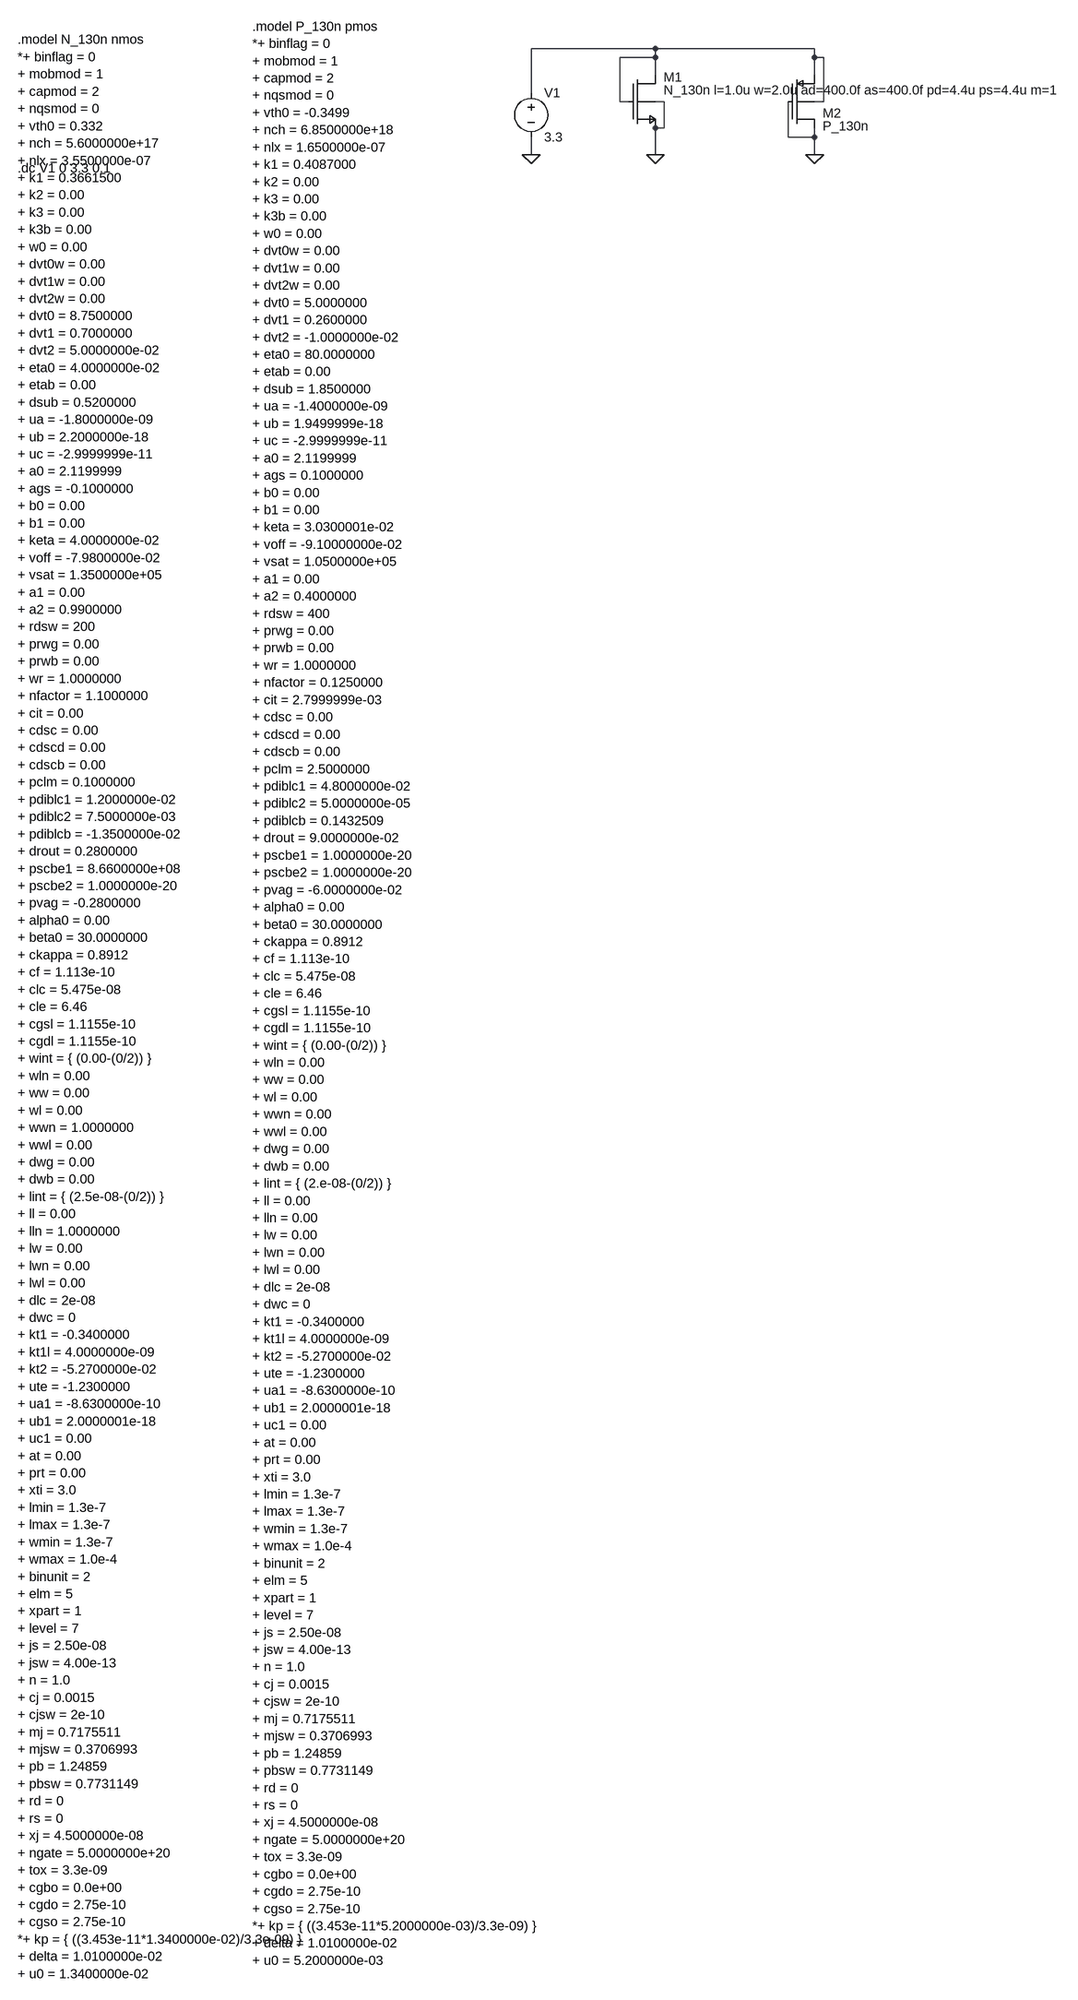
[diagram p0: schematic ekvParameterExtractionEdited.asc]
ekvParameterExtractionEdited.asc, the LTspice schematic file:
Version 4
SHEET 1 880 3184
WIRE 272 32 16 32
WIRE 560 32 272 32
WIRE 272 48 272 32
WIRE 272 48 208 48
WIRE 560 48 560 32
WIRE 576 48 560 48
WIRE 272 80 272 48
WIRE 560 80 560 48
WIRE 16 112 16 32
WIRE 208 128 208 48
WIRE 224 128 208 128
WIRE 288 128 272 128
WIRE 576 128 576 48
WIRE 576 128 560 128
WIRE 288 176 288 128
WIRE 288 176 272 176
WIRE 512 192 512 128
WIRE 560 192 560 176
WIRE 560 192 512 192
WIRE 16 224 16 192
WIRE 272 224 272 176
WIRE 560 224 560 192
FLAG 16 224 0
FLAG 272 224 0
FLAG 560 224 0
SYMBOL voltage 16 96 R0
WINDOW 123 0 0 Left 0
WINDOW 39 0 0 Left 0
SYMATTR InstName V1
SYMATTR Value 3.3
SYMBOL nmosb 224 80 R0
SYMATTR InstName M1
SYMATTR Value2 l=1.0u w=2.0u ad=400.0f as=400.0f pd=4.4u ps=4.4u m=1
SYMATTR Value N_130n l=1.0u w=2.0u ad=400.0f as=400.0f pd=4.4u ps=4.4u m=1
SYMBOL pmosb 512 80 R0
WINDOW 0 63 69 Left 2
SYMATTR InstName M2
SYMATTR Value2 l=1.0u w=6.0u ad=1.2p as=1.2p pd=12.4u ps=12.4u m=1
SYMATTR Value P_130n
TEXT -912 16 Left 2 !.model N_130n nmos \n*+ binflag = 0 \n+ mobmod = 1 \n+ capmod = 2 \n+ nqsmod = 0 \n+ vth0 = 0.332 \n+ nch = 5.6000000e+17 \n+ nlx = 3.5500000e-07 \n+ k1 = 0.3661500 \n+ k2 = 0.00 \n+ k3 = 0.00 \n+ k3b = 0.00 \n+ w0 = 0.00 \n+ dvt0w = 0.00 \n+ dvt1w = 0.00 \n+ dvt2w = 0.00 \n+ dvt0 = 8.7500000 \n+ dvt1 = 0.7000000 \n+ dvt2 = 5.0000000e-02 \n+ eta0 = 4.0000000e-02 \n+ etab = 0.00 \n+ dsub = 0.5200000 \n+ ua = -1.8000000e-09 \n+ ub = 2.2000000e-18 \n+ uc = -2.9999999e-11 \n+ a0 = 2.1199999 \n+ ags = -0.1000000 \n+ b0 = 0.00 \n+ b1 = 0.00 \n+ keta = 4.0000000e-02 \n+ voff = -7.9800000e-02 \n+ vsat = 1.3500000e+05 \n+ a1 = 0.00 \n+ a2 = 0.9900000 \n+ rdsw = 200 \n+ prwg = 0.00 \n+ prwb = 0.00 \n+ wr = 1.0000000 \n+ nfactor = 1.1000000 \n+ cit = 0.00 \n+ cdsc = 0.00 \n+ cdscd = 0.00 \n+ cdscb = 0.00 \n+ pclm = 0.1000000 \n+ pdiblc1 = 1.2000000e-02 \n+ pdiblc2 = 7.5000000e-03 \n+ pdiblcb = -1.3500000e-02 \n+ drout = 0.2800000 \n+ pscbe1 = 8.6600000e+08 \n+ pscbe2 = 1.0000000e-20 \n+ pvag = -0.2800000 \n+ alpha0 = 0.00 \n+ beta0 = 30.0000000 \n+ ckappa = 0.8912 \n+ cf = 1.113e-10 \n+ clc = 5.475e-08 \n+ cle = 6.46 \n+ cgsl = 1.1155e-10 \n+ cgdl = 1.1155e-10 \n+ wint = { (0.00-(0/2)) } \n+ wln = 0.00 \n+ ww = 0.00 \n+ wl = 0.00 \n+ wwn = 1.0000000 \n+ wwl = 0.00 \n+ dwg = 0.00 \n+ dwb = 0.00 \n+ lint = { (2.5e-08-(0/2)) } \n+ ll = 0.00 \n+ lln = 1.0000000 \n+ lw = 0.00 \n+ lwn = 0.00 \n+ lwl = 0.00 \n+ dlc = 2e-08 \n+ dwc = 0 \n+ kt1 = -0.3400000 \n+ kt1l = 4.0000000e-09 \n+ kt2 = -5.2700000e-02 \n+ ute = -1.2300000 \n+ ua1 = -8.6300000e-10 \n+ ub1 = 2.0000001e-18 \n+ uc1 = 0.00 \n+ at = 0.00 \n+ prt = 0.00 \n+ xti = 3.0 \n+ lmin = 1.3e-7 \n+ lmax = 1.3e-7 \n+ wmin = 1.3e-7 \n+ wmax = 1.0e-4 \n+ binunit = 2 \n+ elm = 5\n+ xpart = 1 \n+ level = 7 \n+ js = 2.50e-08 \n+ jsw = 4.00e-13 \n+ n = 1.0 \n+ cj = 0.0015 \n+ cjsw = 2e-10 \n+ mj = 0.7175511 \n+ mjsw = 0.3706993 \n+ pb = 1.24859 \n+ pbsw = 0.7731149 \n+ rd = 0 \n+ rs = 0 \n+ xj = 4.5000000e-08 \n+ ngate = 5.0000000e+20 \n+ tox = 3.3e-09 \n+ cgbo = 0.0e+00 \n+ cgdo = 2.75e-10 \n+ cgso = 2.75e-10 \n*+ kp = { ((3.453e-11*1.3400000e-02)/3.3e-09) } \n+ delta = 1.0100000e-02 \n+ u0 = 1.3400000e-02
TEXT -488 -8 Left 2 !.model P_130n pmos \n*+ binflag = 0 \n+ mobmod = 1 \n+ capmod = 2 \n+ nqsmod = 0 \n+ vth0 = -0.3499 \n+ nch = 6.8500000e+18 \n+ nlx = 1.6500000e-07 \n+ k1 = 0.4087000 \n+ k2 = 0.00 \n+ k3 = 0.00 \n+ k3b = 0.00 \n+ w0 = 0.00 \n+ dvt0w = 0.00 \n+ dvt1w = 0.00 \n+ dvt2w = 0.00 \n+ dvt0 = 5.0000000 \n+ dvt1 = 0.2600000 \n+ dvt2 = -1.0000000e-02 \n+ eta0 = 80.0000000 \n+ etab = 0.00 \n+ dsub = 1.8500000 \n+ ua = -1.4000000e-09 \n+ ub = 1.9499999e-18 \n+ uc = -2.9999999e-11 \n+ a0 = 2.1199999 \n+ ags = 0.1000000 \n+ b0 = 0.00 \n+ b1 = 0.00 \n+ keta = 3.0300001e-02 \n+ voff = -9.10000000e-02 \n+ vsat = 1.0500000e+05 \n+ a1 = 0.00 \n+ a2 = 0.4000000 \n+ rdsw = 400 \n+ prwg = 0.00 \n+ prwb = 0.00 \n+ wr = 1.0000000 \n+ nfactor = 0.1250000 \n+ cit = 2.7999999e-03 \n+ cdsc = 0.00 \n+ cdscd = 0.00 \n+ cdscb = 0.00 \n+ pclm = 2.5000000 \n+ pdiblc1 = 4.8000000e-02 \n+ pdiblc2 = 5.0000000e-05 \n+ pdiblcb = 0.1432509 \n+ drout = 9.0000000e-02 \n+ pscbe1 = 1.0000000e-20 \n+ pscbe2 = 1.0000000e-20 \n+ pvag = -6.0000000e-02 \n+ alpha0 = 0.00 \n+ beta0 = 30.0000000 \n+ ckappa = 0.8912 \n+ cf = 1.113e-10 \n+ clc = 5.475e-08 \n+ cle = 6.46 \n+ cgsl = 1.1155e-10 \n+ cgdl = 1.1155e-10 \n+ wint = { (0.00-(0/2)) } \n+ wln = 0.00 \n+ ww = 0.00 \n+ wl = 0.00 \n+ wwn = 0.00 \n+ wwl = 0.00 \n+ dwg = 0.00 \n+ dwb = 0.00 \n+ lint = { (2.e-08-(0/2)) } \n+ ll = 0.00 \n+ lln = 0.00 \n+ lw = 0.00 \n+ lwn = 0.00 \n+ lwl = 0.00 \n+ dlc = 2e-08 \n+ dwc = 0 \n+ kt1 = -0.3400000 \n+ kt1l = 4.0000000e-09 \n+ kt2 = -5.2700000e-02 \n+ ute = -1.2300000 \n+ ua1 = -8.6300000e-10 \n+ ub1 = 2.0000001e-18 \n+ uc1 = 0.00 \n+ at = 0.00 \n+ prt = 0.00 \n+ xti = 3.0 \n+ lmin = 1.3e-7 \n+ lmax = 1.3e-7 \n+ wmin = 1.3e-7 \n+ wmax = 1.0e-4 \n+ binunit = 2 \n+ elm = 5 \n+ xpart = 1 \n+ level = 7 \n+ js = 2.50e-08 \n+ jsw = 4.00e-13 \n+ n = 1.0 \n+ cj = 0.0015 \n+ cjsw = 2e-10 \n+ mj = 0.7175511 \n+ mjsw = 0.3706993 \n+ pb = 1.24859 \n+ pbsw = 0.7731149 \n+ rd = 0 \n+ rs = 0 \n+ xj = 4.5000000e-08 \n+ ngate = 5.0000000e+20 \n+ tox = 3.3e-09 \n+ cgbo = 0.0e+00 \n+ cgdo = 2.75e-10 \n+ cgso = 2.75e-10 \n*+ kp = { ((3.453e-11*5.2000000e-03)/3.3e-09) } \n+ delta = 1.0100000e-02 \n+ u0 = 5.2000000e-03
TEXT -912 248 Left 2 !.dc V1 0 3.3 0.1

The netlist it stands for:
* ekvParameterExtractionEdited.asc
V1 N001 0 3.3
M1 N001 N001 0 0 N_130n l=1.0u w=2.0u ad=400.0f as=400.0f pd=4.4u ps=4.4u m=1 l=1.0u w=2.0u ad=400.0f as=400.0f pd=4.4u ps=4.4u m=1
M2 0 0 N001 N001 P_130n l=1.0u w=6.0u ad=1.2p as=1.2p pd=12.4u ps=12.4u m=1
.model NMOS NMOS
.model PMOS PMOS
.lib standard.mos
.model N_130n nmos
*+ binflag = 0
+ mobmod = 1
+ capmod = 2
+ nqsmod = 0
+ vth0 = 0.332
+ nch = 5.6000000e+17
+ nlx = 3.5500000e-07
+ k1 = 0.3661500
+ k2 = 0.00
+ k3 = 0.00
+ k3b = 0.00
+ w0 = 0.00
+ dvt0w = 0.00
+ dvt1w = 0.00
+ dvt2w = 0.00
+ dvt0 = 8.7500000
+ dvt1 = 0.7000000
+ dvt2 = 5.0000000e-02
+ eta0 = 4.0000000e-02
+ etab = 0.00
+ dsub = 0.5200000
+ ua = -1.8000000e-09
+ ub = 2.2000000e-18
+ uc = -2.9999999e-11
+ a0 = 2.1199999
+ ags = -0.1000000
+ b0 = 0.00
+ b1 = 0.00
+ keta = 4.0000000e-02
+ voff = -7.9800000e-02
+ vsat = 1.3500000e+05
+ a1 = 0.00
+ a2 = 0.9900000
+ rdsw = 200
+ prwg = 0.00
+ prwb = 0.00
+ wr = 1.0000000
+ nfactor = 1.1000000
+ cit = 0.00
+ cdsc = 0.00
+ cdscd = 0.00
+ cdscb = 0.00
+ pclm = 0.1000000
+ pdiblc1 = 1.2000000e-02
+ pdiblc2 = 7.5000000e-03
+ pdiblcb = -1.3500000e-02
+ drout = 0.2800000
+ pscbe1 = 8.6600000e+08
+ pscbe2 = 1.0000000e-20
+ pvag = -0.2800000
+ alpha0 = 0.00
+ beta0 = 30.0000000
+ ckappa = 0.8912
+ cf = 1.113e-10
+ clc = 5.475e-08
+ cle = 6.46
+ cgsl = 1.1155e-10
+ cgdl = 1.1155e-10
+ wint = { (0.00-(0/2)) }
+ wln = 0.00
+ ww = 0.00
+ wl = 0.00
+ wwn = 1.0000000
+ wwl = 0.00
+ dwg = 0.00
+ dwb = 0.00
+ lint = { (2.5e-08-(0/2)) }
+ ll = 0.00
+ lln = 1.0000000
+ lw = 0.00
+ lwn = 0.00
+ lwl = 0.00
+ dlc = 2e-08
+ dwc = 0
+ kt1 = -0.3400000
+ kt1l = 4.0000000e-09
+ kt2 = -5.2700000e-02
+ ute = -1.2300000
+ ua1 = -8.6300000e-10
+ ub1 = 2.0000001e-18
+ uc1 = 0.00
+ at = 0.00
+ prt = 0.00
+ xti = 3.0
+ lmin = 1.3e-7
+ lmax = 1.3e-7
+ wmin = 1.3e-7
+ wmax = 1.0e-4
+ binunit = 2
+ elm = 5
+ xpart = 1
+ level = 7
+ js = 2.50e-08
+ jsw = 4.00e-13
+ n = 1.0
+ cj = 0.0015
+ cjsw = 2e-10
+ mj = 0.7175511
+ mjsw = 0.3706993
+ pb = 1.24859
+ pbsw = 0.7731149
+ rd = 0
+ rs = 0
+ xj = 4.5000000e-08
+ ngate = 5.0000000e+20
+ tox = 3.3e-09
+ cgbo = 0.0e+00
+ cgdo = 2.75e-10
+ cgso = 2.75e-10
*+ kp = { ((3.453e-11*1.3400000e-02)/3.3e-09) }
+ delta = 1.0100000e-02
+ u0 = 1.3400000e-02
.model P_130n pmos
*+ binflag = 0
+ mobmod = 1
+ capmod = 2
+ nqsmod = 0
+ vth0 = -0.3499
+ nch = 6.8500000e+18
+ nlx = 1.6500000e-07
+ k1 = 0.4087000
+ k2 = 0.00
+ k3 = 0.00
+ k3b = 0.00
+ w0 = 0.00
+ dvt0w = 0.00
+ dvt1w = 0.00
+ dvt2w = 0.00
+ dvt0 = 5.0000000
+ dvt1 = 0.2600000
+ dvt2 = -1.0000000e-02
+ eta0 = 80.0000000
+ etab = 0.00
+ dsub = 1.8500000
+ ua = -1.4000000e-09
+ ub = 1.9499999e-18
+ uc = -2.9999999e-11
+ a0 = 2.1199999
+ ags = 0.1000000
+ b0 = 0.00
+ b1 = 0.00
+ keta = 3.0300001e-02
+ voff = -9.10000000e-02
+ vsat = 1.0500000e+05
+ a1 = 0.00
+ a2 = 0.4000000
+ rdsw = 400
+ prwg = 0.00
+ prwb = 0.00
+ wr = 1.0000000
+ nfactor = 0.1250000
+ cit = 2.7999999e-03
+ cdsc = 0.00
+ cdscd = 0.00
+ cdscb = 0.00
+ pclm = 2.5000000
+ pdiblc1 = 4.8000000e-02
+ pdiblc2 = 5.0000000e-05
+ pdiblcb = 0.1432509
+ drout = 9.0000000e-02
+ pscbe1 = 1.0000000e-20
+ pscbe2 = 1.0000000e-20
+ pvag = -6.0000000e-02
+ alpha0 = 0.00
+ beta0 = 30.0000000
+ ckappa = 0.8912
+ cf = 1.113e-10
+ clc = 5.475e-08
+ cle = 6.46
+ cgsl = 1.1155e-10
+ cgdl = 1.1155e-10
+ wint = { (0.00-(0/2)) }
+ wln = 0.00
+ ww = 0.00
+ wl = 0.00
+ wwn = 0.00
+ wwl = 0.00
+ dwg = 0.00
+ dwb = 0.00
+ lint = { (2.e-08-(0/2)) }
+ ll = 0.00
+ lln = 0.00
+ lw = 0.00
+ lwn = 0.00
+ lwl = 0.00
+ dlc = 2e-08
+ dwc = 0
+ kt1 = -0.3400000
+ kt1l = 4.0000000e-09
+ kt2 = -5.2700000e-02
+ ute = -1.2300000
+ ua1 = -8.6300000e-10
+ ub1 = 2.0000001e-18
+ uc1 = 0.00
+ at = 0.00
+ prt = 0.00
+ xti = 3.0
+ lmin = 1.3e-7
+ lmax = 1.3e-7
+ wmin = 1.3e-7
+ wmax = 1.0e-4
+ binunit = 2
+ elm = 5
+ xpart = 1
+ level = 7
+ js = 2.50e-08
+ jsw = 4.00e-13
+ n = 1.0
+ cj = 0.0015
+ cjsw = 2e-10
+ mj = 0.7175511
+ mjsw = 0.3706993
+ pb = 1.24859
+ pbsw = 0.7731149
+ rd = 0
+ rs = 0
+ xj = 4.5000000e-08
+ ngate = 5.0000000e+20
+ tox = 3.3e-09
+ cgbo = 0.0e+00
+ cgdo = 2.75e-10
+ cgso = 2.75e-10
*+ kp = { ((3.453e-11*5.2000000e-03)/3.3e-09) }
+ delta = 1.0100000e-02
+ u0 = 5.2000000e-03
.dc V1 0 3.3 0.1
.backanno
.end